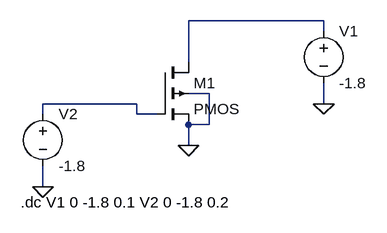
[diagram p0: schematic pmos_output_schematics.asc]
pmos_output_schematics.asc, the LTspice schematic file:
Version 4
SHEET 1 880 680
WIRE 400 48 192 48
WIRE 400 64 400 48
WIRE 192 112 192 48
WIRE 224 160 192 160
WIRE 112 176 -32 176
WIRE 400 176 400 144
WIRE -32 192 -32 176
WIRE 112 192 112 176
WIRE 144 192 112 192
WIRE 224 208 224 160
WIRE 224 208 192 208
WIRE 192 240 192 208
WIRE -32 304 -32 272
FLAG 192 240 0
FLAG 400 176 0
FLAG -32 304 0
SYMBOL pmos4 144 112 R0
SYMATTR InstName M1
SYMATTR Value2 l=1080n w=1080n
SYMBOL voltage 400 48 R0
WINDOW 123 0 0 Left 0
WINDOW 39 0 0 Left 0
SYMATTR InstName V1
SYMATTR Value -1.8
SYMBOL voltage -32 176 R0
WINDOW 123 0 0 Left 0
WINDOW 39 0 0 Left 0
SYMATTR InstName V2
SYMATTR Value -1.8
TEXT -66 328 Left 2 !.dc V1 0 -1.8 0.1 V2 0 -1.8 0.2

The netlist it stands for:
* pmos_output_schematics.asc
M1 N001 N002 0 0 PMOS l=1080n w=1080n
V1 N001 0 -1.8
V2 N002 0 -1.8
.model NMOS NMOS
.model PMOS PMOS
.lib standard.mos
.dc V1 0 -1.8 0.1 V2 0 -1.8 0.2
.backanno
.end